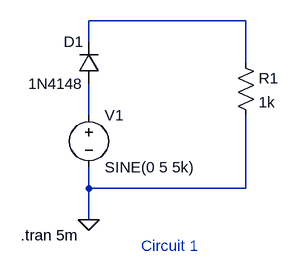
[diagram p0: schematic 5.1 - circuit1.asc]
5.1 - circuit1.asc, the LTspice schematic file:
Version 4
SHEET 1 880 680
WIRE 304 16 64 16
WIRE 64 48 64 16
WIRE 304 80 304 16
WIRE 64 160 64 112
WIRE 64 272 64 240
WIRE 304 272 304 160
WIRE 304 272 64 272
WIRE 64 320 64 272
FLAG 64 320 0
SYMBOL voltage 64 144 R0
WINDOW 123 0 0 Left 0
WINDOW 39 0 0 Left 0
SYMATTR InstName V1
SYMATTR Value SINE(0 5 5k)
SYMBOL diode 80 112 R180
WINDOW 0 24 64 Left 2
WINDOW 3 24 0 Left 2
SYMATTR InstName D1
SYMATTR Value 1N4148
SYMBOL res 288 64 R0
SYMATTR InstName R1
SYMATTR Value 1k
TEXT -40 344 Left 2 !.tran 5m
TEXT 144 360 Left 2 ;Circuit 1

The netlist it stands for:
* 5.1 - circuit1.asc
V1 N002 0 SINE(0 5 5k)
D1 N002 N001 1N4148
R1 N001 0 1k
.model D D
.lib standard.dio
.tran 5m
* Circuit 1
.backanno
.end